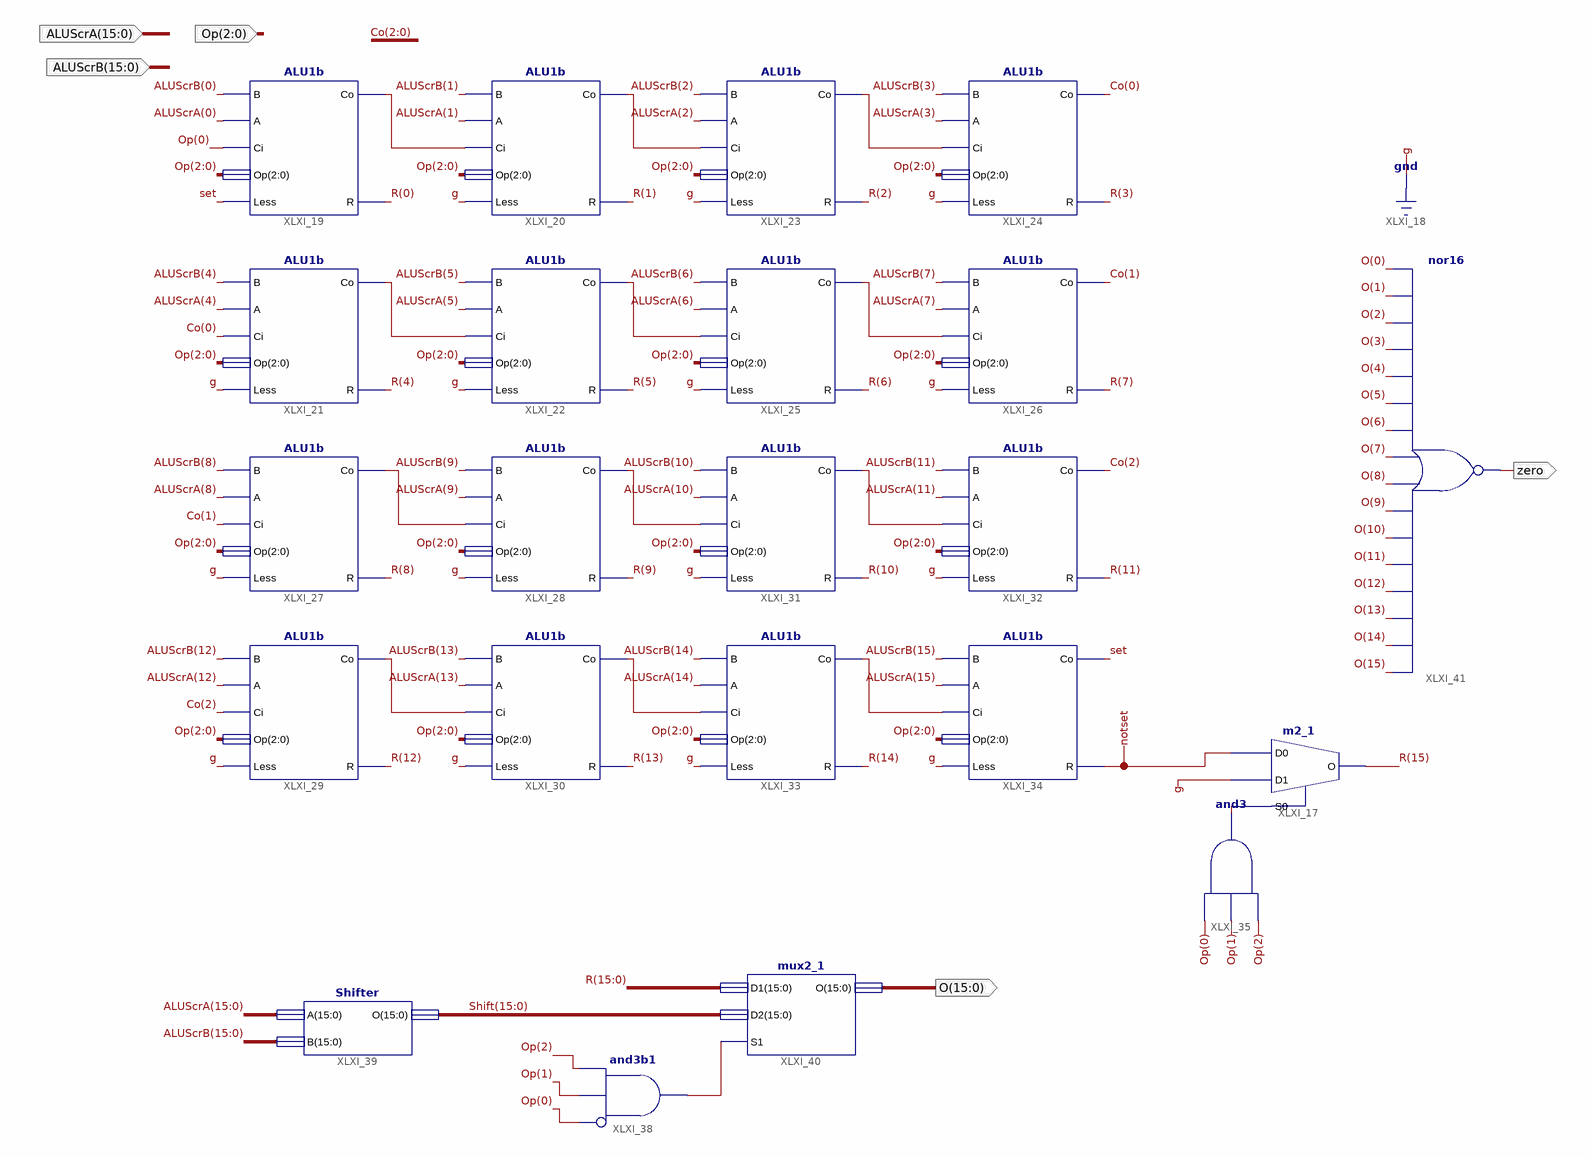
[diagram p0: schematic sheet 1]
// Xilinx ISE schematic ALU16b.sch (spartan3e) as structural Verilog: 22 symbols, 5 ports
module ALU16b (
  input  [15:0] ALUScrA,
  input  [15:0] ALUScrB,
  input  [2:0] Op,
  output zero,
  output [15:0] O
);

  wire notset, set, XLXN_107, XLXN_117, XLXN_131, XLXN_138, XLXN_145, XLXN_152, XLXN_159, XLXN_169, XLXN_187,
       XLXN_194, XLXN_201, XLXN_208, XLXN_215, XLXN_221;
  wire [2:0] Co;
  wire [15:0] R, Shift;

  m2_1 XLXI_17 (.D0(notset), .D1(1'b0), .S0(XLXN_107), .O(R[15]));
  ALU1b XLXI_19 (.B(ALUScrB[0]), .A(ALUScrA[0]), .Ci(Op[0]), .Op(Op), .Less(set), .Co(XLXN_117), .R(R[0]));
  ALU1b XLXI_20 (.B(ALUScrB[1]), .A(ALUScrA[1]), .Ci(XLXN_117), .Op(Op), .Less(1'b0), .Co(XLXN_138), .R(R[1]));
  ALU1b XLXI_21 (.B(ALUScrB[4]), .A(ALUScrA[4]), .Ci(Co[0]), .Op(Op), .Less(1'b0), .Co(XLXN_131), .R(R[4]));
  ALU1b XLXI_22 (.B(ALUScrB[5]), .A(ALUScrA[5]), .Ci(XLXN_131), .Op(Op), .Less(1'b0), .Co(XLXN_152), .R(R[5]));
  ALU1b XLXI_23 (.B(ALUScrB[2]), .A(ALUScrA[2]), .Ci(XLXN_138), .Op(Op), .Less(1'b0), .Co(XLXN_145), .R(R[2]));
  ALU1b XLXI_24 (.B(ALUScrB[3]), .A(ALUScrA[3]), .Ci(XLXN_145), .Op(Op), .Less(1'b0), .Co(Co[0]), .R(R[3]));
  ALU1b XLXI_25 (.B(ALUScrB[6]), .A(ALUScrA[6]), .Ci(XLXN_152), .Op(Op), .Less(1'b0), .Co(XLXN_159), .R(R[6]));
  ALU1b XLXI_26 (.B(ALUScrB[7]), .A(ALUScrA[7]), .Ci(XLXN_159), .Op(Op), .Less(1'b0), .Co(Co[1]), .R(R[7]));
  ALU1b XLXI_27 (.B(ALUScrB[8]), .A(ALUScrA[8]), .Ci(Co[1]), .Op(Op), .Less(1'b0), .Co(XLXN_169), .R(R[8]));
  ALU1b XLXI_28 (.B(ALUScrB[9]), .A(ALUScrA[9]), .Ci(XLXN_169), .Op(Op), .Less(1'b0), .Co(XLXN_194), .R(R[9]));
  ALU1b XLXI_29 (.B(ALUScrB[12]), .A(ALUScrA[12]), .Ci(Co[2]), .Op(Op), .Less(1'b0), .Co(XLXN_187), .R(R[12]));
  ALU1b XLXI_30 (.B(ALUScrB[13]), .A(ALUScrA[13]), .Ci(XLXN_187), .Op(Op), .Less(1'b0), .Co(XLXN_208), .R(R[13]));
  ALU1b XLXI_31 (.B(ALUScrB[10]), .A(ALUScrA[10]), .Ci(XLXN_194), .Op(Op), .Less(1'b0), .Co(XLXN_201), .R(R[10]));
  ALU1b XLXI_32 (.B(ALUScrB[11]), .A(ALUScrA[11]), .Ci(XLXN_201), .Op(Op), .Less(1'b0), .Co(Co[2]), .R(R[11]));
  ALU1b XLXI_33 (.B(ALUScrB[14]), .A(ALUScrA[14]), .Ci(XLXN_208), .Op(Op), .Less(1'b0), .Co(XLXN_215), .R(R[14]));
  ALU1b XLXI_34 (.B(ALUScrB[15]), .A(ALUScrA[15]), .Ci(XLXN_215), .Op(Op), .Less(1'b0), .Co(set), .R(notset));
  and XLXI_35 (XLXN_107, Op[2], Op[1], Op[0]);
  and XLXI_38 (XLXN_221, ~Op[0], Op[1], Op[2]);  // and3b1
  Shifter XLXI_39 (.A(ALUScrA), .B(ALUScrB), .O(Shift));
  mux2_1 XLXI_40 (.D1(R), .D2(Shift), .S1(XLXN_221), .O(O));
  nor XLXI_41 (zero, O[15], O[14], O[13], O[12], O[11], O[10], O[9], O[8], O[7], O[6], O[5], O[4], O[3], O[2], O[1], O[0]);
endmodule
